# EAGLE design motordriver (EAGLE 9.1.3)
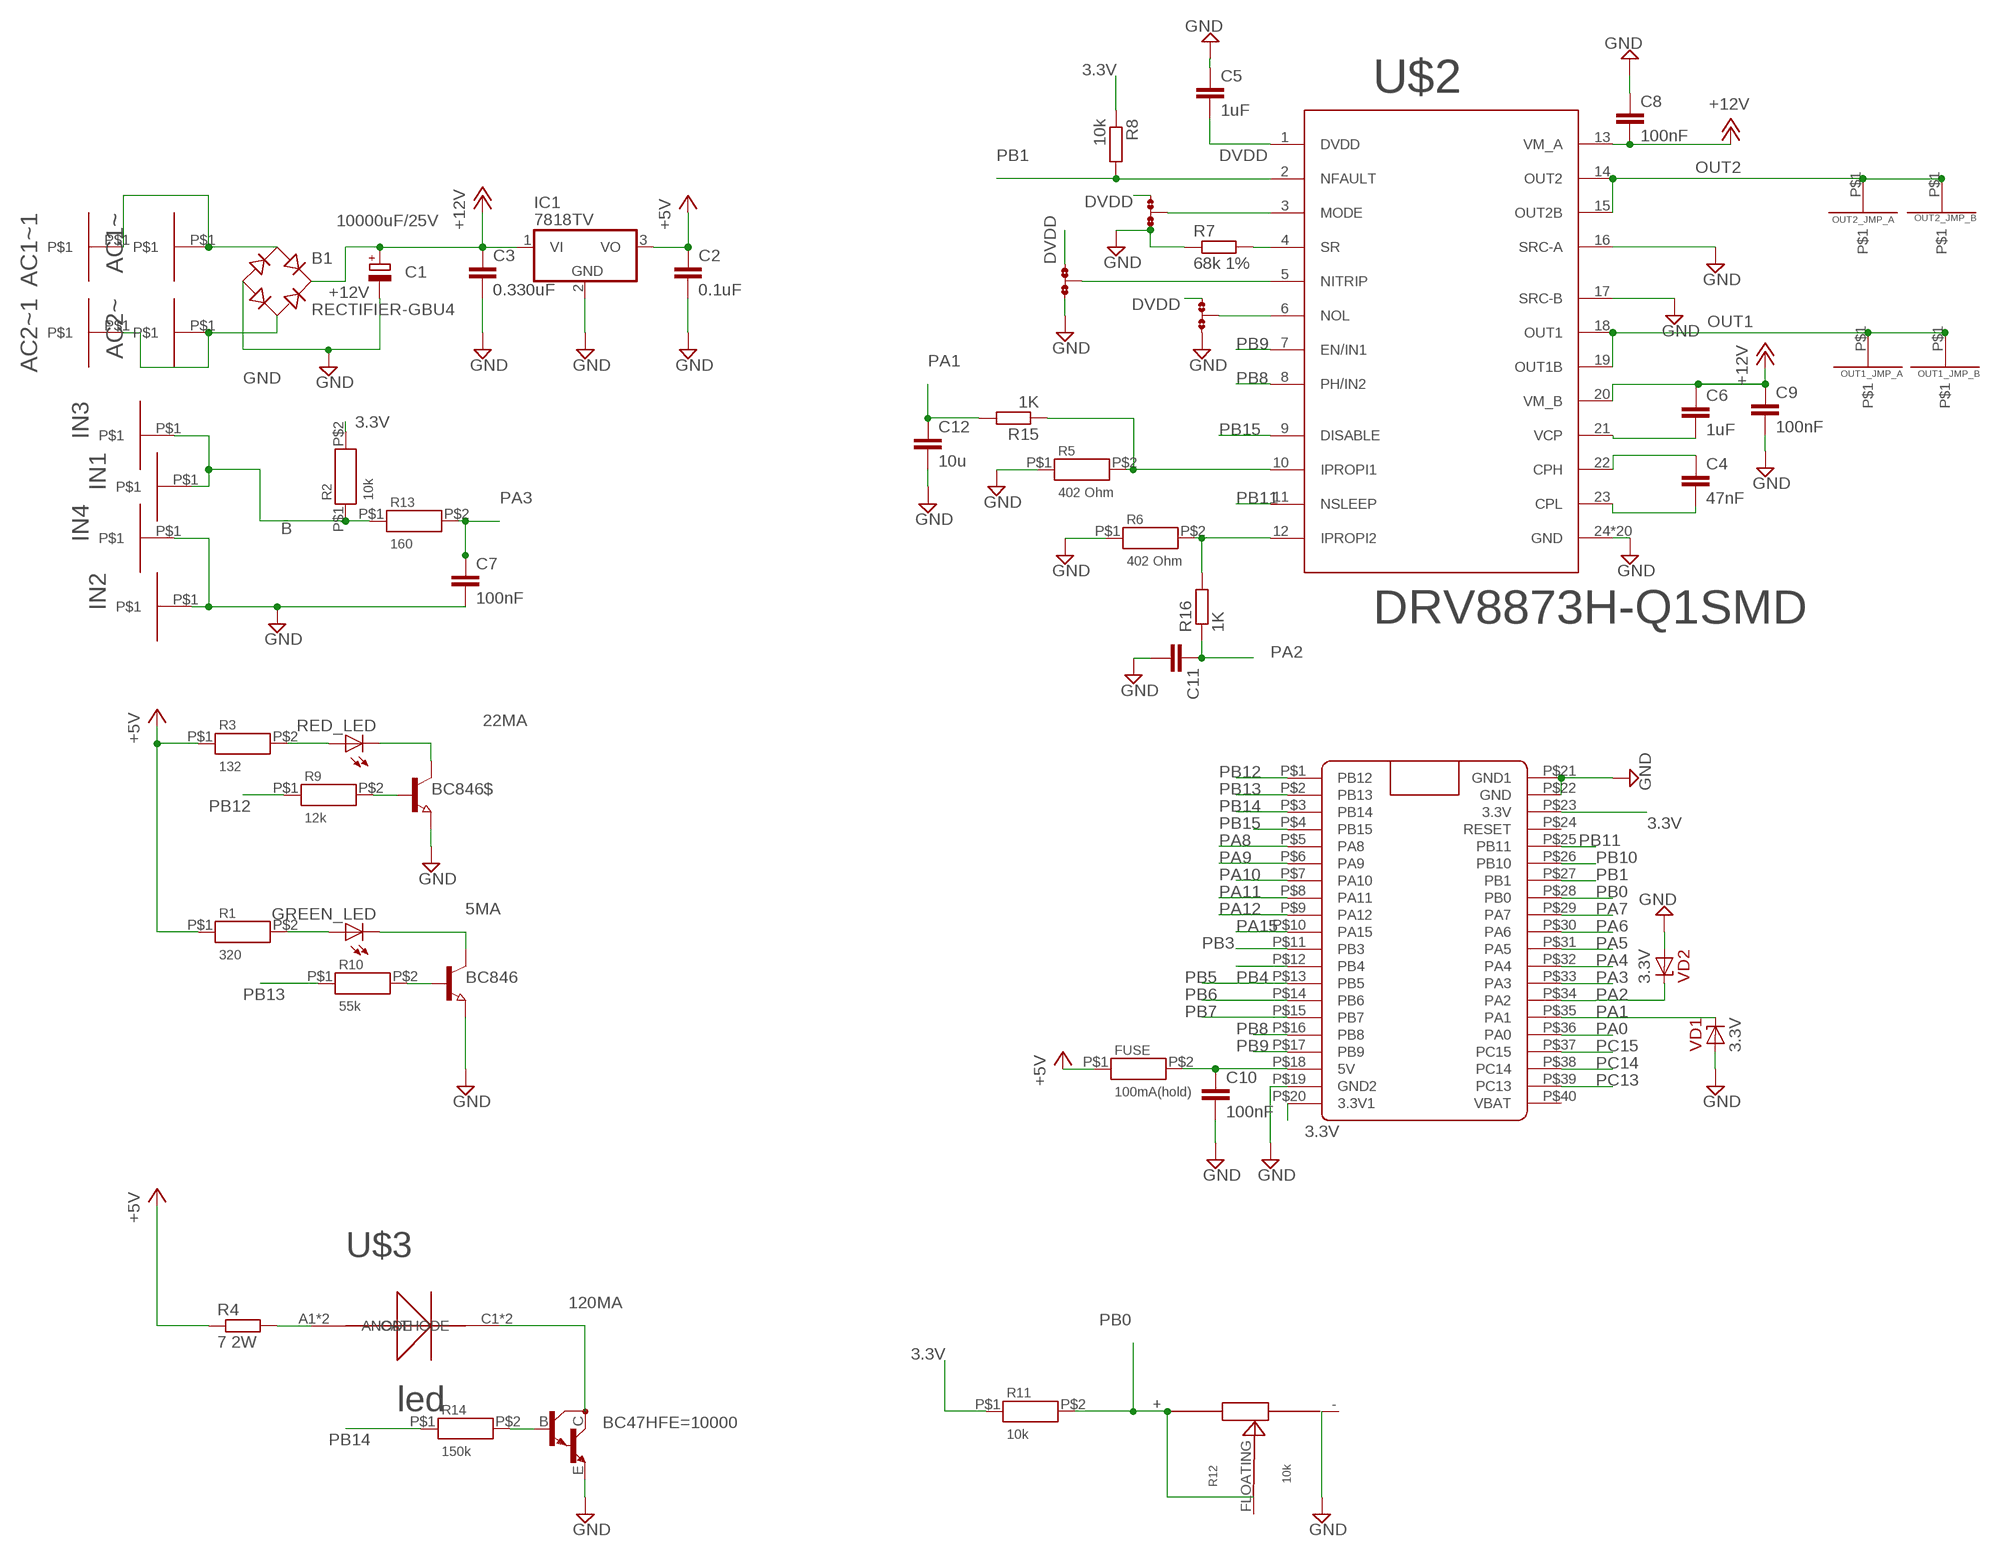
[diagram p0: schematic, sheet 1]

## Parts
AC1~  SMDPAD  [1.5X7MMPAD]
AC1~1  SMDPAD  [1.5X7MMPAD]
AC2~  SMDPAD  [1.5X7MMPAD]
AC2~1  SMDPAD  [1.5X7MMPAD]
B1  RECTIFIER-GBU4  [GBU4]
BC47HFE=10000  MMBTA14LT1  [SOT23-BEC]
BC846  NPN-TRANSISTOR_SOT23  [SOT23]
BC846$  NPN-TRANSISTOR_SOT23  [SOT23]
C1  10000uF/25V  CPOL-EUE7.5-18  [E7,5-18]
C2  0.1uF  C-EUC1206  [C1206]
C3  0.330uF  C-EUC1206  [C1206]
C4  47nF  C-EUC1206K  [C1206K]
C5  1uF  C-EUC1206K  [C1206K]
C6  1uF  C-EUC1206K  [C1206K]
C7  100nF  C-EUC1206  [C1206]
C8  100nF  C-EUC0805  [C0805]
C9  100nF  C-EUC0805  [C0805]
C10  100nF  C-EUC0805K  [C0805K]
C11  C-EUC0805K  [C0805K]
C12  10u  C-EUC0805K  [C0805K]
FUSE  100mA(hold)  RESISTOR0805_SMD  [0805]
GREEN_LED  LEDCHIPLED_0805  [CHIPLED_0805]
IC1  7818TV  [TO220V]
IN1  SMDPAD  [1.5X7MMPAD]
IN2  SMDPAD  [1.5X7MMPAD]
IN3  SMDPAD  [1.5X7MMPAD]
IN4  SMDPAD  [1.5X7MMPAD]
JMP1  0R-JUMPA  [A0R-JMP]
JMP2  0R-JUMPA  [A0R-JMP]
JMP3  0R-JUMPA  [A0R-JMP]
OUT1_JMP_A  SMDPAD  [1.5X7MMPAD]
OUT1_JMP_B  SMDPAD  [1.5X7MMPAD]
OUT2_JMP_A  SMDPAD  [1.5X7MMPAD]
OUT2_JMP_B  SMDPAD  [1.5X7MMPAD]
R1  320  RESISTOR0805_SMD  [0805]
R2  10k  RESISTOR0805_SMD  [0805]
R3  132  RESISTOR0805_SMD  [0805]
R4  7 2W  R-EU_R1210  [R1210]
R5  402 Ohm  RESISTOR0805_SMD  [0805]
R6  402 Ohm  RESISTOR0805_SMD  [0805]
R7  68k 1%  R-EU_R0805  [R0805]
R8  10k  R-EU_R0805  [R0805]
R9  12k  RESISTOR0805_SMD  [0805]
R10  55k  RESISTOR0805_SMD  [0805]
R11  10k  RESISTOR0805_SMD  [0805]
R12  10k  POTENTIOMETER  [3X1MM]
R13  160  RESISTOR0805_SMD  [0805]
R14  150k  RESISTOR0805_SMD  [0805]
R15  1K  R-EU_R0805  [R0805]
R16  1K  R-EU_R0805  [R0805]
RED_LED  LEDCHIPLED_0805  [CHIPLED_0805]
U$1  BLUE_PILL  [BLUE_PILL]
U$2  DRV8873H-Q1SMD  [HTSSOP24]
U$3  POWER_LED  [OSRAMLED]
VD1  3.3V  5.6V(1N5232)  [DO35-7]
VD2  3.3V  5.6V(1N5232)  [DO35-7]

## Nets
3.3V: R2.P$2 R8.1 R11.P$1 U$1.P$20(3.3V1) U$1.P$23(3.3V)
5MA: BC846.3(C) GREEN_LED.C
22MA: BC846$.3(C) RED_LED.C
120MA: BC47HFE=10000.C U$3.C1(CATHODE) U$3.C2(CATHODE)
+5V: C2.1 FUSE.P$1 IC1.3(VO) R1.P$1 R3.P$1 R4.1
+12V: B1.+ C1.+ C3.1 C6.1 C8.2 C9.1 IC1.1(VI) U$2.13(VM_A) U$2.20(VM_B)
B: IN1.P$1 IN3.P$1 R2.P$1 R13.P$1
DVDD: C5.2 JMP1.1 JMP2.1 JMP3.1 U$2.1(DVDD)
GND: B1.- BC47HFE=10000.E BC846$.2(E) BC846.2(E) C1.- C2.2 C3.2 C5.1 C7.2 C8.1 C9.2 C10.2 C11.2 C12.2 IC1.2(GND) IN2.P$1 IN4.P$1 JMP1.3 JMP2.3 JMP3.3 R5.P$1 R6.P$1 R7.1 R12.- U$1.P$19(GND2) U$1.P$21(GND1) U$1.P$22(GND) U$2.16(SRC-A) U$2.17(SRC-B) U$2.24(GND) U$2.GND_(GND) U$2.P$1(GND) U$2.P$2(GND) U$2.P$3(GND) U$2.P$4(GND) U$2.P$5(GND) U$2.P$6(GND) U$2.P$7(GND) U$2.P$8(GND) U$2.P$9(GND) U$2.P$10(GND) U$2.P$11(GND) U$2.P$12(GND) U$2.P$13(GND) U$2.P$14(GND) U$2.P$15(GND) U$2.P$16(GND) U$2.P$18(GND) U$2.P$19(GND) VD1.A VD2.A
N$1: AC1~1.P$1 AC1~.P$1 B1.AC1
N$2: AC2~1.P$1 AC2~.P$1 B1.AC2
N$3: C4.1 U$2.22(CPH)
N$4: C4.2 U$2.23(CPL)
N$5: JMP2.2 U$2.6(NOL)
N$8: JMP1.2 U$2.5(NITRIP)
N$9: JMP3.2 U$2.3(MODE)
N$10: R7.2 U$2.4(SR)
N$11: C6.2 U$2.21(VCP)
N$14: R3.P$2 RED_LED.A
N$15: GREEN_LED.A R1.P$2
N$18: BC846$.1(B) R9.P$2
N$20: BC846.1(B) R10.P$2
N$23: R4.2 U$3.A1(ANODE) U$3.A2(ANODE)
N$24: BC47HFE=10000.B R14.P$2
N$26: C10.1 FUSE.P$2 U$1.P$18(5V)
N$100: R5.P$2 R15.1 U$2.10(IPROPI1)
N$101: R6.P$2 R16.2 U$2.12(IPROPI2)
OUT1: OUT1_JMP_A.P$1 OUT1_JMP_B.P$1 U$2.18(OUT1) U$2.19(OUT1B)
OUT2: OUT2_JMP_A.P$1 OUT2_JMP_B.P$1 U$2.14(OUT2) U$2.15(OUT2B)
PA0: U$1.P$36(PA0)
PA1: C12.1 R15.2 U$1.P$35(PA1) VD1.C
PA2: C11.1 R16.1 U$1.P$34(PA2) VD2.C
PA3: C7.1 R13.P$2 U$1.P$33(PA3)
PA4: U$1.P$32(PA4)
PA5: U$1.P$31(PA5)
PA6: U$1.P$30(PA6)
PA7: U$1.P$29(PA7)
PA8: U$1.P$5(PA8)
PA9: U$1.P$6(PA9)
PA10: U$1.P$7(PA10)
PA11: U$1.P$8(PA11)
PA12: U$1.P$9(PA12)
PA15: U$1.P$10(PA15)
PB0: R11.P$2 R12.+ R12.FLOATING U$1.P$28(PB0)
PB1: R8.2 U$1.P$27(PB1) U$2.2(NFAULT)
PB3: U$1.P$11(PB3)
PB4: U$1.P$12(PB4)
PB5: U$1.P$13(PB5)
PB6: U$1.P$14(PB6)
PB7: U$1.P$15(PB7)
PB8: U$1.P$16(PB8) U$2.8(PH/IN2)
PB9: U$1.P$17(PB9) U$2.7(EN/IN1)
PB10: U$1.P$26(PB10)
PB11: U$1.P$25(PB11) U$2.11(NSLEEP)
PB12: R9.P$1 U$1.P$1(PB12)
PB13: R10.P$1 U$1.P$2(PB13)
PB14: R14.P$1 U$1.P$3(PB14)
PB15: U$1.P$4(PB15) U$2.9(DISABLE)
PC13: U$1.P$39(PC13)
PC14: U$1.P$38(PC14)
PC15: U$1.P$37(PC15)
Unconnected: U$1.P$24(RESET) U$1.P$40(VBAT)

## Library data of the parts
AC1~ AC1~1 AC2~ AC2~1 IN1-IN4 OUT1_JMP_A OUT1_JMP_B OUT2_JMP_A OUT2_JMP_B = myLibrary:SMDPAD
B1 = rectifier:RECTIFIER-: Rectifier
BC47HFE=10000 = transistor-npn:MMBTA14*: NPN Darlington Transistor
BC846 BC846$ = semicon-smd-ipc:NPN-TRANSISTOR_: NPN TRANSISTOR
C1 = rcl:CPOL-EU: POLARIZED CAPACITOR, European symbol; SPICEPREFIX: C
C2-C12 = rcl:C-EU: CAPACITOR, European symbol; SPICEPREFIX: C
FUSE R1-R3 R5 R6 R9-R11 R13 R14 = myLibrary:RESISTOR
GREEN_LED RED_LED = led:LED: LED OSRAM: - CHIPLED LG R971, LG N971, LY N971, LG Q971, LY Q971, LO R971, LY R971 LH N974, LH R974 LS Q976, LO Q976, LY Q976 LO Q996 - Hyper CHIPLED LW Q18S LB Q993, LB Q99A, LB R99A - SideLED LS A670, LO A670, LY A670, LG A670, LP A670 LB A673, LV A673, LT A673, LW A673 LH A674 LY A675 LS A676, LA A676, LO A676, LY A676, LW A676 LS A679, LY A679, LG A679 - Hyper Micro SIDELED® LS Y876, LA Y876, LO Y876, LY Y876 LT Y87S - SmartLED LW L88C, LW L88S LB L89C, LB L89S, LG L890 LS L89K, LO L89K, LY L89K LS L896, LA L896, LO L896, LY L896 - TOPLED LS T670, LO T670, LY T670, LG T670, LP T670 LSG T670, LSP T670, LSY T670, LOP T670, LYG T670 LG T671, LOG T671, LSG T671 LB T673, LV T673, LT T673, LW T673 LH T674 LS T676, LA T676, LO T676, LY T676, LB T676, LH T676, LSB T676, LW T676 LB T67C, LV T67C, LT T67C, LS T67K, LO T67K, LY T67K, LW E67C LS E67B, LA E67B, LO E67B, LY E67B, LB E67C, LV E67C, LT E67C LW T67C LS T679, LY T679, LG T679 LS T770, LO T770, LY T770, LG T770, LP T770 LB T773, LV T773, LT T773, LW T773 LH T774 LS E675, LA E675, LY E675, LS T675 LS T776, LA T776, LO T776, LY T776, LB T776 LHGB T686 LT T68C, LB T68C - Hyper Mini TOPLED® LB M676 - Mini TOPLED Santana® LG M470 LS M47K, LO M47K, LY M47K Source: http://www.osram.convergy.de LUXEON: - LUMILED® LXK2-PW12-R00, LXK2-PW12-S00, LXK2-PW14-U00, LXK2-PW14-V00 LXK2-PM12-R00, LXK2-PM12-S00, LXK2-PM14-U00 LXK2-PE12-Q00, LXK2-PE12-R00, LXK2-PE12-S00, LXK2-PE14-T00, LXK2-PE14-U00 LXK2-PB12-K00, LXK2-PB12-L00, LXK2-PB12-M00, LXK2-PB14-N00, LXK2-PB14-P00, LXK2-PB14-Q00 LXK2-PR12-L00, LXK2-PR12-M00, LXK2-PR14-Q00, LXK2-PR14-R00 LXK2-PD12-Q00, LXK2-PD12-R00, LXK2-PD12-S00 LXK2-PH12-R00, LXK2-PH12-S00 LXK2-PL12-P00, LXK2-PL12-Q00, LXK2-PL12-R00 Source: www.luxeon.com KINGBRIGHT: KA-3528ASYC Source: www.kingbright.com
IC1 = linear:78*: Positive VOLTAGE REGULATOR Source: http://cache.national.com/ds/LM/LM78L05.pdf http://www.fairchildsemi.com/ds/LM/LM7805.pdf
JMP1-JMP3 = jump-0r-smd:0R-JUMP: SMD 0R 0805 Jumper
R4 R7 R8 R15 R16 = resistor:R-EU_: RESISTOR, European symbol
R12 = myLibrary:POTENTIOMETER
U$1 = bluePill:BLUE_PILL
U$2 = myLibrary:DRV8873H-Q1: H-Bridge Motor Driver • Drives One DC Motor, One Winding of a Stepper Motor, or Solenoid Loads • 4.5-V to 38-V Operating Voltage Range • 10-A Peak Current Drive • Low HS + LS R DS(ON) – 150 m Ω at T J = 25°C, 13.5 V – 250 m Ω at T J = 150°C, 13.5 V • Current Mirror for Output Current Sensing • Configurable Control Interface – PH/EN – PWM (IN1/IN2) – Independent Half-Bridge Control • Supports 1.8-V, 3.3-V, 5-V Logic Inputs
U$3 = myLibrary:POWER_LED: osram power led white
VD1 VD2 = zener:?; MOUSER: 583-1N5232B-B

## Board
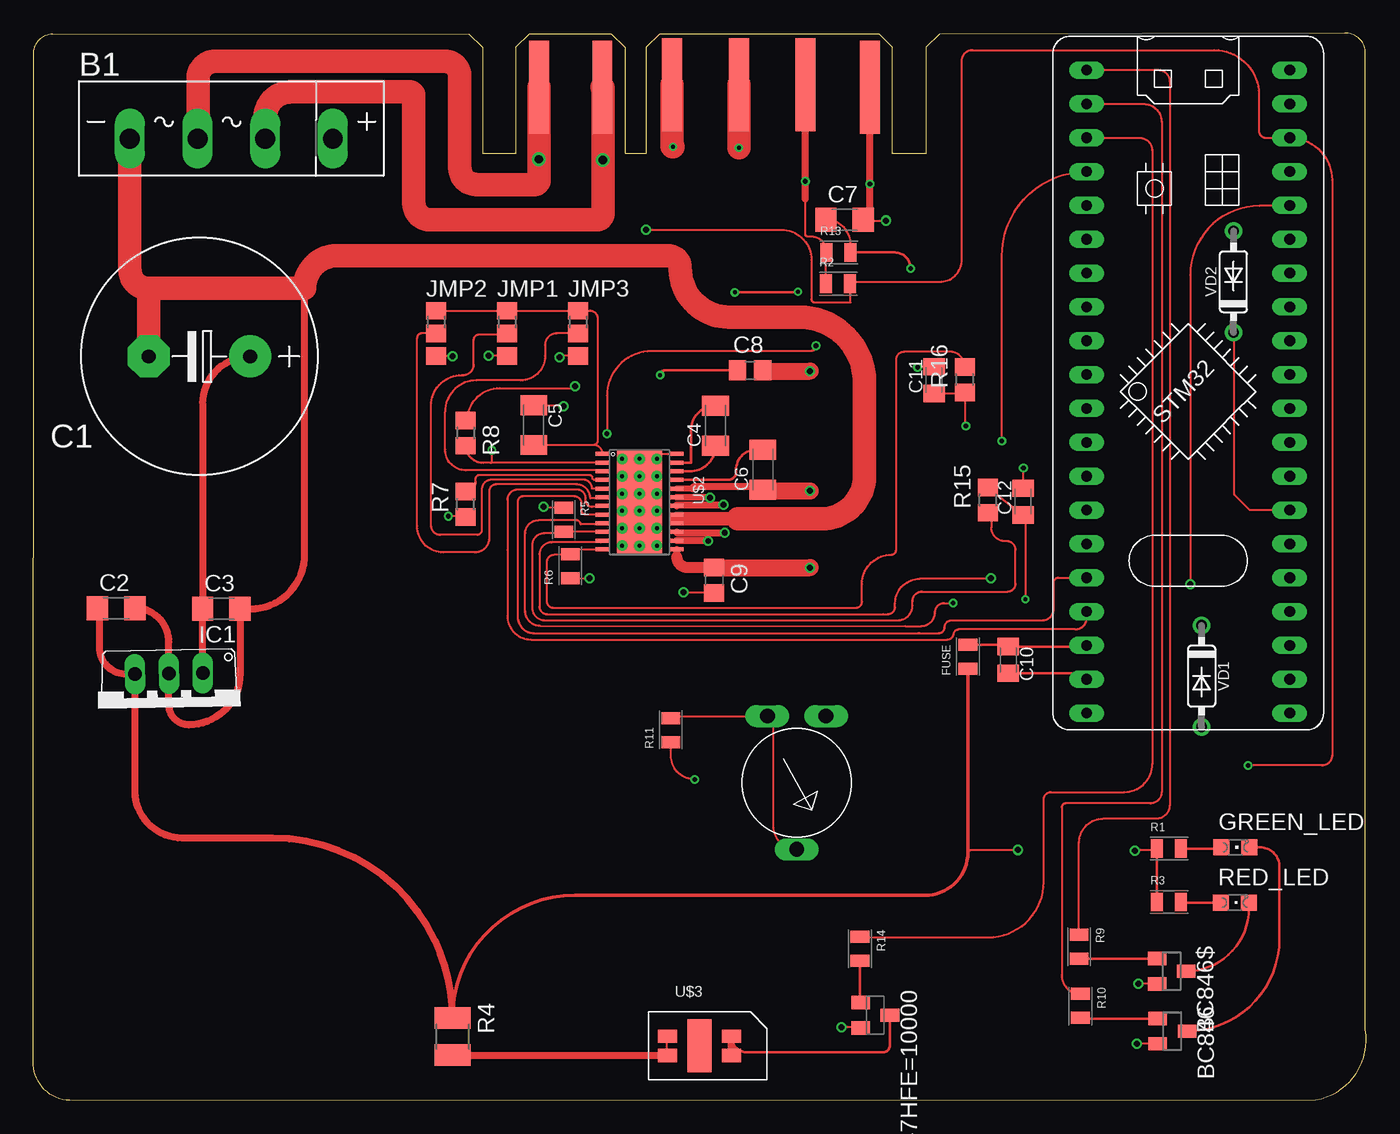
[diagram p1: board, top side]
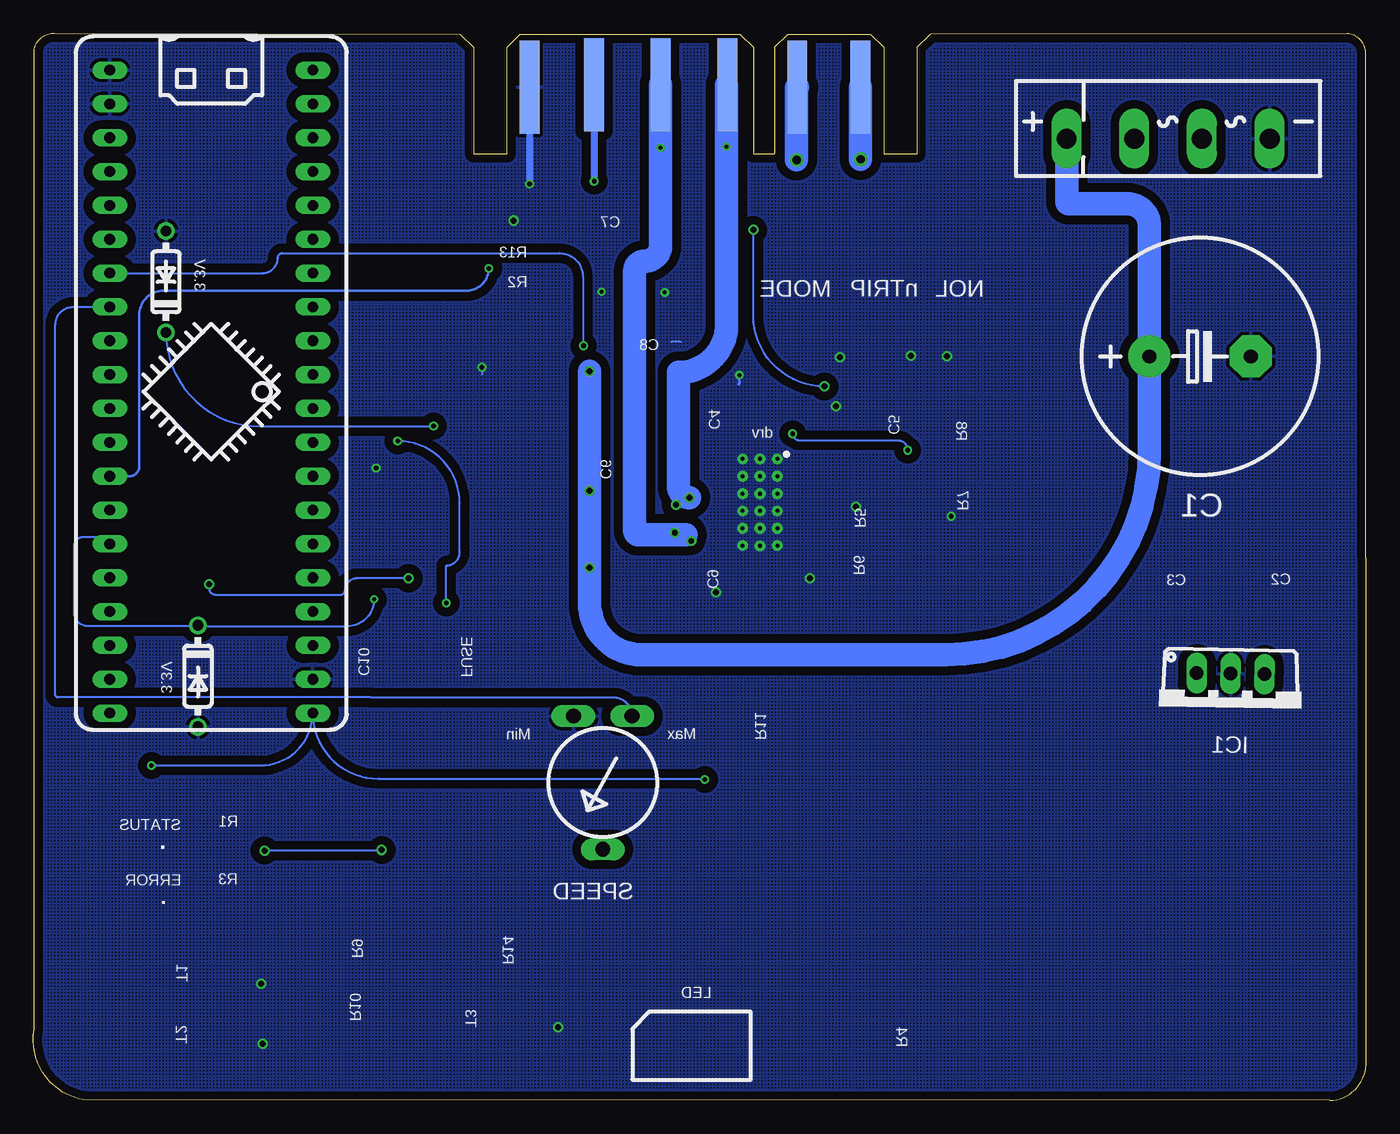
[diagram p2: board, bottom side, seen from below]

Size 100.09 x 80.1 mm. Coordinates in mm from the lower left corner, seen from the top.
Outline: 2.72,0 96.29,0.05 arc90 100.03,5.31 100.03,78.74 arc90 98.48,80.1 68.03,80.05 67.03,79.05 67.03,71.05 64.53,71.05 64.53,79.05 63.53,80.05 47.03,80.05 46.03,79.05 46.03,71.05 44.43,71.05 44.43,79.05 43.43,80.05 37.23,80.05 36.23,79.05 36.23,71.05 33.73,71.05 33.73,79.05 32.73,80.05 1.45,80.08 arc90 0.03,78.51 0,2.95 arc90 2.72,0
Copper layers (1*16): Top 0.035mm / dielectric 1.5mm / Bottom 0.035mm
Design rules "SeeedStudio_2layer_DRU_no_angle_20140221": minimum track width 6mil, minimum drill 12mil, track to track 6mil, track to pad 6mil, pad to pad 6mil, via to via 6mil, smd to smd 0mil, copper to edge 10mil, drill to drill 10mil, minimum pad ring 10mil, minimum via ring 6mil, stop-mask expansion 2mil, vias tented up to drill 100mil, thermal gap 10mil

### Footprints (pad centres in the part's own frame; a part is rotated, then mirrored left to right if it is on the bottom)
1.5X7MMPAD = smd 1.5 x 7: P$1 0,0
GBU4 = drill 1.499 long: + 7.62,0; - -7.62,0; AC1 2.54,0; AC2 -2.54,0
SOT23-BEC = smd 1 x 1.4: B -0.95,-1.1; C 0,1.1; E 0.95,-1.1
SOT23 = smd 1 x 1.4: 1 -0.95,-1.1; 2 0.95,-1.1; 3 0,1.1
E7,5-18 = drill 1.016 pad 3.15: + -3.81,0 | drill 1.016 pad 3.15 octagon: - 3.81,0
C1206 = smd 1.6 x 1.8: 1 -1.4,0; 2 1.4,0
C1206K = smd 1.5 x 2: 1 -1.5,0; 2 1.5,0
C0805 = smd 1.3 x 1.5: 1 -0.95,0; 2 0.95,0
C0805K = smd 1.3 x 1.6: 1 -1,0; 2 1,0
0805 = smd 0.9 x 1.4: P$1 -0.9,0; P$2 0.9,0
CHIPLED_0805 = smd 1.2 x 1.2: A 0,-1.05; C 0,1.05
TO220V = drill 1.016 long: 1 -2.54,-2.54; 2 0,-2.54; 3 2.54,-2.54
A0R-JMP = smd 1.5 x 1.3: 1 0,1.7; 2 0,0; 3 0,-1.7
R1210 = smd 1.6 x 2.7: 1 -1.4,0; 2 1.4,0
R0805 = smd 1.3 x 1.5: 1 -0.95,0; 2 0.95,0
3X1MM = drill 1.1 pad 1.422 long: + -2.2,5; - 2.2,5; FLOATING 0,-5
BLUE_PILL = drill 0.8 long: P$1 -7.62,15.24; P$2 -7.62,12.7; P$3 -7.62,10.16; P$4 -7.62,7.62; P$5 -7.62,5.08; P$6 -7.62,2.54; P$7 -7.62,0; P$8 -7.62,-2.54; P$9 -7.62,-5.08; P$10 -7.62,-7.62; P$11 -7.62,-10.16; P$12 -7.62,-12.7; P$13 -7.62,-15.24; P$14 -7.62,-17.78; P$15 -7.62,-20.32; P$16 -7.62,-22.86; P$17 -7.62,-25.4; P$18 -7.62,-27.94; P$19 -7.62,-30.48; P$20 -7.62,-33.02; P$21 7.62,15.24; P$22 7.62,12.7; P$23 7.62,10.16; P$24 7.62,7.62; P$25 7.62,5.08; P$26 7.62,2.54; P$27 7.62,0; P$28 7.62,-2.54; P$29 7.62,-5.08; P$30 7.62,-7.62; P$31 7.62,-10.16; P$32 7.62,-12.7; P$33 7.62,-15.24; P$34 7.62,-17.78; P$35 7.62,-20.32; P$36 7.62,-22.86; P$37 7.62,-25.4; P$38 7.62,-27.94; P$39 7.62,-30.48; P$40 7.62,-33.02
HTSSOP24 = smd 0.3 x 1.05: 1 -3.625,-2.775; 2 -2.975,-2.775; 3 -2.325,-2.775; 4 -1.675,-2.775; 5 -1.025,-2.775; 6 -0.375,-2.775; 7 0.275,-2.775; 8 0.925,-2.775; 9 1.575,-2.775; 10 2.225,-2.775; 11 2.875,-2.775; 12 3.525,-2.775; 13 3.525,2.775; 14 2.875,2.775; 15 2.225,2.775; 16 1.575,2.775; 17 0.925,2.775; 18 0.275,2.775; 19 -0.375,2.775; 20 -1.025,2.775; 21 -1.675,2.775; 22 -2.325,2.775; 23 -2.975,2.775; 24 -3.625,2.775 | smd 7.8 x 3.4: GND_ 0,0 | drill 0.3 pad 0.45: P$1 -3.25,1.3; P$2 0.65,1.3; P$3 -0.65,1.3; P$4 -1.95,1.3; P$5 1.95,1.3; P$6 3.25,1.3; P$7 -3.25,0; P$8 -1.95,0; P$9 -0.65,0; P$10 0.65,0; P$11 1.95,0; P$12 3.275,0; P$13 -3.25,-1.3; P$14 -1.95,-1.3; P$15 1.95,-1.3; P$16 0.65,-1.3; P$18 -0.65,-1.3; P$19 3.25,-1.3
OSRAMLED = smd 1.4 x 1: A1 -2.4,0.715; A2 -2.4,-0.715; C1 2.4,0.715; C2 2.4,-0.715 | smd 1.8 x 4: P$1 0,0
DO35-7 = drill 0.813: A 3.81,0; C -3.81,0

### Placement (x,y rotation side)
AC1~  42.73,76.05 0 top
AC1~1  42.73,76.05 0 bottom
AC2~  37.98,76.05 0 top
AC2~1  37.98,76.05 0 bottom
B1  14.88,72.2 0 top
BC47HFE=10000  63.23,6.4 270 top
BC846  85.53,5.2 270 top
BC846$  85.48,9.7 270 top
C1  12.48,55.85 180 top
C2  6.23,36.95 0 top
C3  14.13,36.9 0 top
C4  51.23,50.65 90 top
C5  37.58,50.7 270 top
C6  54.78,47.35 90 top
C7  60.93,66.1 0 top
C8  53.83,54.8 0 top
C9  51.13,39.05 270 top
C10  73.2,33.07 270 top
C11  67.64,54.08 90 top
C12  74.32,44.96 90 top
FUSE  70.18,33.3 90 top
GREEN_LED  90.28,19 270 top
IC1  10.23,29.5 181 top
IN1  57.98,76.25 0 top
IN2  62.83,76.05 0 top
IN3  57.98,76.25 0 bottom
IN4  62.83,76.05 0 bottom
JMP1  35.59,57.58 0 top
JMP2  30.25,57.58 0 top
JMP3  40.92,57.58 0 top
OUT1_JMP_A  47.98,76.25 0 top
OUT1_JMP_B  47.98,76.25 0 bottom
OUT2_JMP_A  52.98,76.25 0 top
OUT2_JMP_B  52.98,76.25 0 bottom
R1  85.28,18.9 0 top
R2  60.43,61.3 0 top
R3  85.28,14.9 0 top
R4  31.48,4.8 270 top
R5  39.83,43.6 270 top
R6  40.33,40.1 90 top
R7  32.48,44.75 90 top
R8  32.48,50.1 270 top
R9  78.53,11.55 270 top
R10  78.63,7.1 270 top
R11  47.88,27.8 90 top
R12  57.33,23.85 0 top
R13  60.48,63.65 0 top
R14  62.08,11.4 270 top
R15  71.68,45.06 90 top
R16  69.95,54.1 90 top
RED_LED  90.23,14.85 270 top
U$1  86.73,62.1 0 top
U$2  45.53,44.9 270 top
U$3  50.03,4.1 0 top
VD1  87.73,31.85 270 top
VD2  90.13,61.45 90 top

### Tracks (layer width: path | path; a pad name or v marks a point on that pad's centre or on a via)
3.3V  (via drill 0.35, 0.45 pad 0.7)
  Top 0.152: v46.03,65.35 56.18,65.35 arc-90 58.43,63.1 58.43,60.15 arc90 58.68,59.9 61.38,59.9 arc90 61.38,59.9 61.38,61.24 R2.P$2 arc-90 61.48,61.45 68.08,61.45 arc90 69.73,63.1 69.73,78.05 arc-90 70.53,78.85 88.68,78.85 arc-90 92.03,75.5 92.03,72.8 arc90 92.57,72.26 U$1.P$23 arc-90 97.53,69.08 97.53,25.9 arc-90 96.78,25.15 v91.23,25.15 | v49.68,24.1 arc-90 47.88,25.9 R11.P$1 | R8.1 32.6,51.05 arc-90 35.03,53.47 40.55,53.47 v40.68,53.6
  Bottom 0.152: v40.68,53.6 arc90 46.03,58.95 v46.03,65.35 | v91.23,25.15 83.04,25.15 arc-90 U$1.P$20 arc-90 74.18,24.15 57.33,24.15 49.71,24.15 arc90 49.72,24.14 v49.68,24.1
5MA
  Top 0.203: BC846.3 arc90 93.58,12.15 93.58,17.55 arc90 92.13,19 GREEN_LED.C
22MA
  Top 0.203: BC846$.3 arc90 91.28,14.4 RED_LED.C
120MA
  Top 0.203: U$3.C1 arc90 53.64,3.6 63.78,3.6 arc90 64.33,4.15 BC47HFE=10000.C
  Top 0.508: U$3.C2 U$3.C1
+5V  (via drill 0.45 pad 0.7)
  Top 0.152: 70.18,18.6 arc-90 70.38,18.8 v73.93,18.8 | v82.73,18.75 arc-90 82.78,18.8 84.38,18.8
  Top 0.203: R1.P$1 84.38,18.8 R3.P$1
  Top 0.254: FUSE.P$1 70.18,18.6 arc-90 66.98,15.4 40.68,15.4 arc90 R4.1
  Top 0.508: C2.1 arc-90 4.98,36.8 4.98,34 arc90 6.98,32 IC1.3 7.64,23.23 arc90 11.18,19.7 17.98,19.7 arc-65 30.17,12 arc-25 R4.1
  Bottom 0.152: v73.93,18.8 arc90 73.98,18.75 v82.73,18.75
+12V  (via drill 0.45 pad 0.7)
  Top 0.152: 48.34,45.92 U$2.20
  Top 0.254: 48.33,41.35 arc90 U$2.13
  Top 0.457: 49.45,45.92 48.34,45.92
  Top 0.508: IC1.1 C3.1 arc-90 C3.1 12.73,52.29 arc-90 C1.+ | C6.1 arc90 54.58,46.05 49.58,46.05 arc-90 49.45,45.92 | 48.33,40.8 48.33,41.35
  Top 0.813: C9.1 49.13,40 arc-90 48.33,40.8
  Top 1.27: C6.1 arc90 54.88,45.75 v58.33,45.75 | C8.2 arc90 54.83,54.75 v58.33,54.75 | C9.1 v58.33,40
  Bottom 1.778: B1.+ 22.5,67.52 arc-90 22.28,67.3 17.93,67.3 arc90 16.28,65.65 C1.+ | v58.33,54.75 v58.33,45.75 v58.33,40 58.33,37.35 arc-90 54.43,33.45 31.58,33.45 arc-90 16.28,48.75 C1.+ | C1.+ arc-90 C1.+
B  (via drill 0.35)
  Top 0.152: R2.P$1 59.53,63.6 arc-90 R13.P$1 arc90 58.38,64.85 58.13,64.85 arc-90 57.98,65 57.98,67.65
  Top 0.508: 57.98,67.65 v57.98,69 IN3.P$1
  Bottom 0.508: IN3.P$1 v57.98,69
DVDD
  Top 0.152: U$2.1 arc90 42.08,49.2 | 42.08,49.2 C5.2 | JMP2.1 JMP1.1 JMP3.1 41.79,59.28 arc-90 42.38,58.7 42.38,49.5 arc-90 42.08,49.2
GND  (via drill 0.3, 0.35, 0.45 pad 0.7)
  Top 0.152: JMP2.3 31.44,55.88 arc-90 v31.48,55.85 | JMP1.3 34.19,55.88 arc-90 v34.18,55.9 | JMP3.3 39.61,55.88 arc90 v39.53,55.8 | C5.1 39.73,52.2 arc-90 v39.83,52.1 | R5.P$1 38.38,44.5 arc-90 v38.33,44.55 | R6.P$1 v41.78,39.2 | C9.2 48.88,38.1 v48.83,38.15 | C7.2 arc90 62.38,66.05 v64.03,66.05 | BC846.2 v82.88,4.25 | BC846$.2 v82.98,8.75 | BC47HFE=10000.E arc90 62.08,5.5 v60.68,5.5 | U$2.GND_ 45.53,46.66 | U$2.GND_ 45.53,47.2 46.28,47.95 | U$2.GND_ 44.63,45.8 | 44.63,45.8 44.6,45.8 | 44.6,45.8 44.28,45.8 | U$2.GND_ 44.38,43.75 44.33,43.75 | U$2.GND_ 46.43,43.99 | U$2.GND_ 46.48,43.95 | 48.3,43.65 U$2.16 | U$2.24 48.3,48.51 46.86,48.51 arc-90 46.83,48.48 U$2.P$1 46.83,46.2 arc-90 U$2.GND_ | R7.1 arc90 32.43,43.85 v31.18,43.85 | C11.2 66.43,55.08 arc90 v66.4,55.04 | C12.2 arc90 74.35,45.98 v74.35,47.47 | U$2.GND_ arc90 44.63,45.8 | 44.63,45.8 44.6,45.8
  Top 0.203: C8.1 47.43,54.8 arc90 v47.08,54.45 | v52.68,60.65 57.38,60.65 arc90 v57.43,60.7 | C10.2 78.66,32.07 arc-90 U$1.P$19
  Top 0.305: U$2.17 U$2.16
  Top 0.508: 48.58,62.45 48.58,62.5 | 20.38,61 20.38,40.95 arc-90 16.33,36.9 C3.2 15.53,32.05 arc-90 11.68,28.2 arc-90 10.18,29.69 IC1.2 10.18,34.39 arc90 C2.2 | C7.2 arc90 62.83,66.6 v62.83,68.8 IN4.P$1
  Top 1.016: 52.91,43.65 48.3,43.65
  Top 1.778: 52.91,43.65 59.18,43.65 arc90 62.43,46.9 62.43,53.9 arc55 60.37,57.89 arc35 57.53,58.8 52.23,58.8 arc-48 49.5,60.03 arc-42 48.58,62.45 | 48.58,62.5 arc90 47.68,63.4 34.77,63.4 22.78,63.4 arc90 20.38,61 arc-90 20.33,60.95 8.67,60.95 | C1.- 8.67,60.95 | 8.67,60.95 arc-90 7.26,62.36 B1.-
  Bottom 0.152: 51.48,56.95 52.18,56.95 | v66.4,55.04 66.4,54.51
  Bottom 0.203: v47.08,54.45 47.08,53.8 | 47.08,53.8 arc90 47.13,53.75 arc-90 47.08,53.8
  Bottom 0.508: IN4.P$1 62.83,70.61 v62.83,68.8
  pour Bottom (isolate 0.66, hatched): 0.18,79.95 100.18,79.95 100.18,0.1 100.08,0.1 0.08,0.1 0.08,79.95
N$1  (via drill 0.64 pad 1.02)
  Top 1.778: AC1~1.P$1 arc-90 42.78,76 v42.78,70.6 42.78,66.6 arc-90 42.28,66.1 29.83,66.1 arc-90 28.58,67.35 28.58,75.4 arc90 28.28,75.7 19.33,75.7 arc90 17.42,73.79 B1.AC1
  Bottom 1.778: AC1~1.P$1 arc-90 42.78,76 v42.78,70.6
N$2  (via drill 0.64 pad 1.02)
  Top 1.778: B1.AC2 arc90 12.38,72.24 12.38,76.7 arc-90 13.68,78 30.93,78 arc-90 32.03,76.9 32.03,70 arc90 33.28,68.75 37.63,68.75 arc90 37.98,69.1 v37.98,70.65 AC2~1.P$1
  Bottom 1.778: AC2~1.P$1 v37.98,70.65
N$3
  Top 0.203: U$2.22 49.3,47.23 arc90 C4.1
N$4
  Top 0.203: U$2.23 49.35,47.88 arc90 49.38,47.9 49.38,50.3 arc-90 C4.2
N$5
  Top 0.152: U$2.6 arc-90 42.68,45.2 41.83,45.2 arc90 40.78,46.25 34.78,46.25 arc90 34.23,45.7 34.23,42.2 arc-90 33.16,41.14 30.8,41.14 arc-90 28.83,43.11 28.83,57.25 arc-90 29.16,57.58 JMP2.2
N$8
  Top 0.152: U$2.5 41.95,45.93 arc90 41.28,46.6 34.43,46.6 arc90 33.68,45.85 33.68,42.8 arc-90 33.33,42.45 30.58,42.45 arc-90 29.87,43.16 29.87,52.14 arc-90 32.18,54.45 32.27,54.45 arc90 33.08,55.25 33.08,57.1 arc-90 33.48,57.5 35.5,57.5 arc90 JMP1.2
N$9
  Top 0.152: U$2.3 arc90 42.68,47.3 32.48,47.3 arc-90 30.93,48.85 30.93,51.71 arc-90 33.26,54.05 36.6,54.05 arc90 38.43,55.87 38.43,56.7 arc-90 39.31,57.58 JMP3.2
N$10
  Top 0.152: U$2.4 42.15,46.58 arc-90 41.98,46.75 arc90 41.78,46.95 33.48,46.95 arc90 33.23,46.7 33.23,46.45 arc-90 R7.2
N$11
  Top 0.203: C6.2 54.28,48.85 arc90 52.78,47.35 52.78,47.15 arc-90 52.23,46.6 48.33,46.6 arc90 U$2.21
N$14
  Top 0.203: R3.P$2 arc90 86.23,14.85 RED_LED.A
N$15
  Top 0.203: GREEN_LED.A arc-90 89.13,18.9 R1.P$2
N$18
  Top 0.203: BC846$.1 R9.P$2
N$20
  Top 0.203: R10.P$2 arc90 78.68,6.15 BC846.1
N$23
  Top 0.152: U$3.A1 47.57,4.77 47.57,3.56 U$3.A2
  Top 0.508: R4.2 arc90 31.49,3.39 U$3.A2
N$24
  Top 0.203: BC47HFE=10000.B arc-90 62.08,7.4 R14.P$2
N$26
  Top 0.203: FUSE.P$2 73.07,34.2 arc-90 C10.1 79.02,34.07 arc90 U$1.P$18
N$100
  Top 0.152: U$2.10 arc90 42.73,42.7 R5.P$2 arc-90 39.7,42.57 38.35,42.57 arc90 37.47,41.68 37.47,36.98 arc90 38.4,36.04 57.63,36.04 64.92,36.04 arc90 66.01,37.13 66.01,37.46 arc-90 66.75,38.2 73.18,38.2 arc90 73.76,38.79 73.76,41.3 arc90 73.08,41.99 72.95,41.99 arc-90 71.93,43 71.93,43.86 arc90 R15.1
N$101
  Top 0.152: U$2.12 arc-90 42.73,41.35 40.93,41.35 arc-90 40.58,41 R6.P$2 arc-90 40.27,40.94 39.09,40.94 arc90 38.56,40.41 38.56,37.46 arc90 39.04,36.98 61.77,36.98 arc90 62.23,37.44 62.23,38.76 arc-90 64.44,40.97 arc90 64.8,41.33 64.8,55.6 arc-90 65.41,56.21 68.79,56.21 arc-90 R16.2
OUT1  (via drill 0.3, 0.45 pad 0.7)
  Top 0.483: 50.8,45.28 U$2.19
  Top 0.508: v50.83,45.25 arc90 50.8,45.28 | U$2.18 arc-90 48.38,44.7 v51.83,44.7
  Top 1.778: OUT1_JMP_B.P$1 47.98,71.65 arc90 v48.03,71.6
  Bottom 0.508: OUT1_JMP_B.P$1 arc-90 48.03,76.2 | v51.83,44.7 arc90 51.28,45.25 v50.83,45.25
  Bottom 1.778: 48.03,76.2 v48.03,71.6 48.03,58.25 arc90 51.63,54.65 51.63,46.05 arc-90 v50.83,45.25
OUT2  (via drill 0.3, 0.43 pad 0.69)
  Top 0.508: v50.68,42 arc90 50.65,42.03 U$2.14 | U$2.15 arc90 48.36,42.61 v51.93,42.61
  Top 1.778: OUT2_JMP_B.P$1 v52.98,71.5
  Bottom 0.508: 51.08,42.45 arc90 50.68,42.05 v50.68,42 | v51.93,42.61 51.93,42.45
  Bottom 1.778: OUT2_JMP_B.P$1 v52.98,71.5 52.98,64.2 arc90 54.18,63 arc-90 54.93,62.25 54.93,42.8 arc-90 54.58,42.45 51.93,42.45 51.08,42.45
PA1  (via drill 0.3)
  Top 0.152: R15.2 C12.1 74.5,43.77 v74.5,37.61
  Bottom 0.152: v74.5,37.61 arc90 76.51,35.6 87.33,35.6 | 87.88,35.6 95.98,35.6 arc90 97.03,36.65 97.03,41.6 arc90 96.33,42.3 94.53,42.3 arc90 94.35,42.12 U$1.P$35
  Bottom 0.305: 87.33,35.6 VD1.C 87.88,35.6
PA2  (via drill 0.35)
  Top 0.152: VD2.C 90.2,57.57 90.2,45.47 91.35,44.32 U$1.P$34 | C11.1 69.88,53.08 arc90 R16.1 69.95,50.7 arc90 v70.03,50.62
  Bottom 0.152: VD2.C arc-90 83.09,50.6 70.05,50.6 arc-90 v70.03,50.62
PA3  (via drill 0.35)
  Top 0.152: R13.P$2 61.38,64.25 arc90 C7.1
  Top 0.203: v65.89,62.46 arc90 64.7,63.65 R13.P$2
  Bottom 0.203: U$1.P$33 92.86,46.86 arc-90 92.13,47.6 92.13,58.98 arc90 90.32,60.78 67.56,60.78 arc-90 v65.89,62.46
PB0
  Top 0.152: R12.FLOATING arc-90 55.58,20.6 55.58,28.4 arc90 R12.+ 48.03,28.85 arc90 R11.P$2
  Bottom 0.152: U$1.P$28 97.12,59.56 arc-90 98.43,58.25 98.43,30.45 arc-90 98.23,30.25 74.73,30.25 arc90 74.74,30.24 56.52,30.24 arc90 R12.+
PB1  (via drill 0.35)
  Top 0.152: U$2.2 arc-90 42.73,47.85 34.33,47.85 | R8.2 arc90 33.78,47.85 34.33,47.85 | v58.78,56.65 arc-90 58.38,56.25 46.43,56.25 arc90 43.08,52.9 v43.08,50.05 | v34.43,48.8 34.43,47.95 arc-90 34.33,47.85
  Bottom 0.152: U$1.P$27 82.88,62.1 arc-90 81.73,63.25 arc90 81.38,63.6 60.58,63.6 arc90 58.83,61.85 58.83,56.5 arc-90 58.78,56.55 v58.78,56.65 | v43.08,50.05 arc-90 42.58,49.55 35.18,49.55 arc90 v34.43,48.8
PB8
  Top 0.152: U$2.8 41.49,43.98 arc-90 41.18,44.29 41.18,44.8 arc90 40.62,45.35 36.78,45.35 arc90 36.38,44.95 36.38,41.8 36.38,36.3 arc90 37.6,35.07 66.45,35.07 | 66.54,35.07 66.45,35.07 | U$1.P$16 76.97,39.24 arc90 76.63,38.9 76.63,36.9 arc-90 75.77,36.04 68.96,36.04 arc90 68.43,35.51 arc-90 67.99,35.07 66.54,35.07 | 66.45,35.07 66.54,35.07
PB9
  Top 0.152: U$1.P$17 79.11,36.23 arc-90 78.24,35.36 arc-90 78.23,35.36 69.48,35.36 arc90 69.11,34.99 69.11,35.08 arc-90 68.64,34.6 37.38,34.6 arc-90 35.6,36.38 35.6,41.32 35.6,45.07 arc-90 36.38,45.85 40.83,45.85 arc-90 41.47,45.2 41.47,45.05 arc90 41.98,44.55 42.67,44.55 U$2.7
PB11  (via drill 0.45 pad 0.7)
  Top 0.152: U$1.P$25 arc-90 94.32,67.15 92.08,67.15 arc90 86.88,61.95 v86.88,38.75 | v71.9,39.2 71.85,39.15 66.55,39.15 arc90 64.72,37.32 64.72,37.06 arc-90 64.16,36.5 63.83,36.5 38.59,36.5 arc-90 38,37.08 38,40.97 arc-90 38.93,41.9 42.63,41.9 U$2.11
  Bottom 0.152: v71.9,39.2 75.74,39.2 arc-90 76.71,38.23 arc90 76.96,37.97 86.44,37.97 arc90 86.88,38.41 v86.88,38.75
PB12
  Top 0.152: U$1.P$1 arc-90 U$1.P$1 84.48,77.35 arc-90 85.33,76.5 85.33,22.15 arc-90 84.33,21.15 80.33,21.15 arc90 78.53,19.35 R9.P$1
PB13
  Top 0.152: R10.P$1 arc-90 77.23,9.4 77.23,22 arc-90 77.53,22.3 83.88,22.3 arc90 84.73,23.15 84.73,73.45 arc90 83.38,74.8 U$1.P$2
PB14
  Top 0.152: U$1.P$3 arc90 U$1.P$3 83.08,72.25 arc-90 84.03,71.3 84.03,25.25 arc-90 81.93,23.15 76.43,23.15 arc90 75.88,22.6 75.88,16.4 arc-90 71.73,12.25 62.13,12.25 arc-90 R14.P$1
PB15  (via drill 0.35)
  Top 0.152: U$2.9 arc-90 42.67,43.25 41.09,43.25 arc90 40.79,43.55 37.93,43.55 arc90 36.93,42.55 36.93,36.76 arc90 38.06,35.62 65.48,35.61 66.68,35.61 arc90 67.72,36.65 arc-90 68.4,37.34 v69.08,37.34 v69.08,37.35 | v72.73,49.5 72.73,63.34 arc-90 U$1.P$4
  Bottom 0.152: v69.08,37.35 69.08,40.15 arc-90 68.08,41.15 68.08,44.85 arc-90 v72.73,49.5

### Text on the board
bsilk: C7 | R13 | R2 | 3.3V | NOL | nTRIP | MODE | C8 | R8 | C5 | drv | C4 | C6 | C1 | R7 | R5 | C9 | C2 | C3 | R6 | C10 | 3.3V | FUSE | IC1 | R11 | Max | Min | R1 | STATUS | R3 | ERROR | SPEED | R14 | R9 | T1 | LED | R10 | T3 | T2 | R4